# EAGLE design DC_Power (EAGLE 7.7.0)
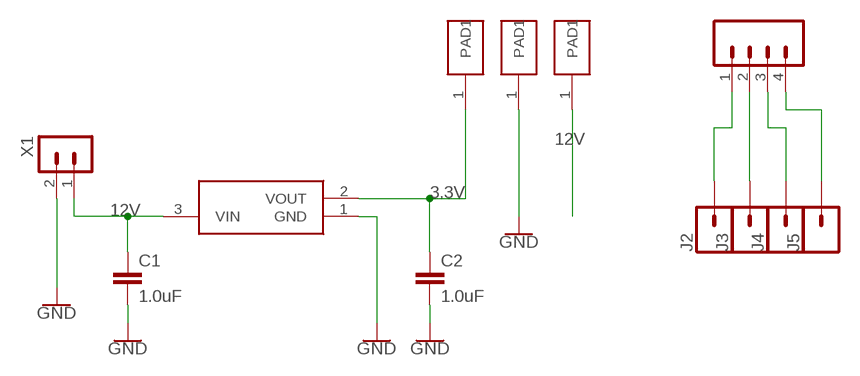
[diagram p0: schematic, sheet 1]

## Parts
C1  1.0uF  1.0UF-0805-25V-10%  [0805]
C2  1.0uF  1.0UF-0805-25V-10%  [0805]
IC1  MCP1700T-3302E_TT  [SOT95P237X112-3N]
J1  CONN_041.27MM  [1X04_1.27MM]
J2  CONN_01PTH_NO_SILK_YES_STOP  [1X01_NO_SILK]
J3  CONN_01PTH_NO_SILK_YES_STOP  [1X01_NO_SILK]
J4  CONN_01PTH_NO_SILK_YES_STOP  [1X01_NO_SILK]
J5  CONN_01PTH_NO_SILK_YES_STOP  [1X01_NO_SILK]
U$1  SINGLE_1.27MM_HOLE  [1.27MM_SINGLE_HOLE]
U$2  SINGLE_1.27MM_HOLE  [1.27MM_SINGLE_HOLE]
U$3  SINGLE_1.27MM_HOLE  [1.27MM_SINGLE_HOLE]
X1  BM02B-SRSS-TB  [BM02B-SRSS-TB]

## Nets
3.3V: C2.1 IC1.2(VOUT) U$1.1(PAD1)
12V: C1.1 IC1.3(VIN) U$3.1(PAD1) X1.1
GND: C1.2 C2.2 IC1.1(GND) U$2.1(PAD1) X1.2
N$1: J1.1 J2.1
N$2: J1.2 J3.1
N$3: J1.3 J4.1
N$4: J1.4 J5.1

## Library data of the parts
C1 C2 = SparkFun-Capacitors:1.0UF: 1µF ceramic capacitors A capacitor is a passive two-terminal electrical component used to store electrical energy temporarily in an electric field.; PROD_ID: CAP-08064
IC1 = MCXI_master_lib:MCP1700T-3302E_TT: LDO voltage regulator 250mA Isupply 1uA Source: Datasheet <https://datasheet.datasheetarchive.com/originals/distributors/SFDatasheet-4/sf-00090030.pdf>; DESCRIPTION: LDO voltage regulator 250mA Isupply 1uA; HEIGHT: 1.12mm; MANUFACTURER_NAME: Microchip; MANUFACTURER_PART_NUMBER: MCP1700T-3302E/TT; MOUSER_PART_NUMBER: 579-MCP1700T3302E/TT; MOUSER_PRICE-STOCK: https://www.mouser.co.uk/ProductDetail/Microchip-Technology-Atmel/MCP1700T-3302E-TT?qs=fM4xO01eazPmCNDrdHEdaw%3D%3D
J1 = MCXI_master_lib:CONN_04: Multi connection point. Often used as Generic Header-pin footprint for 0.1 inch spaced/style header connections On any of the 0.1 inch spaced packages, you can populate with these: Break Away Headers - Straight <https://www.sparkfun.com/products/116> (PRT-00116) Break Away Male Headers - Right Angle <https://www.sparkfun.com/products/553> (PRT-00553) Female Headers <https://www.sparkfun.com/products/115> (PRT-00115) Break Away Headers - Machine Pin <https://www.sparkfun.com/products/117> (PRT-00117) Break Away Female Headers - Swiss Machine Pin <https://www.sparkfun.com/products/743> (PRT-00743) For SCREWTERMINALS and SPRING TERMINALS visit here: Screw Terimnals on SparkFun.com <https://www.sparkfun.com/search/results?term=Screw+Terminals> (5mm/3.5mm/2.54mm spacing) This device is also useful as a general connection point to wire up your design to another part of your project. Our various solder wires solder well into these plated through hole pads. Hook-Up Wire - Assortment (Stranded, 22 AWG) <https://www.sparkfun.com/products/11375> (PRT-11375) Hook-Up Wire - Assortment (Solid Core, 22 AWG) <https://www.sparkfun.com/products/11367> (PRT-11367) View the entire wire category on our website here <https://www.sparkfun.com/categories/141> Special notes: Molex polarized connector foot print use with SKU : PRT-08231 with associated crimp pins and housings. 1MM SMD Version SKU: PRT-10208
J2-J5 = MCXI_master_lib:CONN_01: Single connection point. Often used as Generic Header-pin footprint for 0.1 inch spaced/style header connections On any of the 0.1 inch spaced packages, you can populate with these: Break Away Headers - Straight <https://www.sparkfun.com/products/116> (PRT-00116) Break Away Male Headers - Right Angle <https://www.sparkfun.com/products/553> (PRT-00553) Female Headers <https://www.sparkfun.com/products/115> (PRT-00115) Break Away Headers - Machine Pin <https://www.sparkfun.com/products/117> (PRT-00117) Break Away Female Headers - Swiss Machine Pin <https://www.sparkfun.com/products/743> (PRT-00743) This device is also useful as a general connection point to wire up your design to another part of your project. Our various solder wires solder well into these plated through hole pads. Hook-Up Wire - Assortment (Stranded, 22 AWG) <https://www.sparkfun.com/products/11375> (PRT-11375) Hook-Up Wire - Assortment (Solid Core, 22 AWG) <https://www.sparkfun.com/products/11367> (PRT-11367) View the entire wire category on our website here <https://www.sparkfun.com/categories/141> Special notes: SMTSO-256-ET is a "flush mount" nut for a 4-40 screw. We mostly use this on specialty testbeds; it is a nice way to connect hardware to your PCB at an adjustable hieght. Also note, the SNAP packages are for using a snappable style connector. We sell a baggie of snaps and they are also used on two LilyPad designs: Snap Assortment - 30 pack (male and female) <https://www.sparkfun.com/products/11347> (DEV-11347) LilyPad Arduino SimpleSnap <https://www.sparkfun.com/products/10941> (DEV-10941) LilyPad SimpleSnap Protoboard <https://www.sparkfun.com/products/10940> (DEV-10940)
U$1-U$3 = MCXI_master_lib:SINGLE_1.27MM_HOLE
X1 = con-JST SH:BM02B-SRSS: JST SH series header 1.00mm pitch disconnectable crimp style connectors, vertical (side entry type), 2 pins

## Board
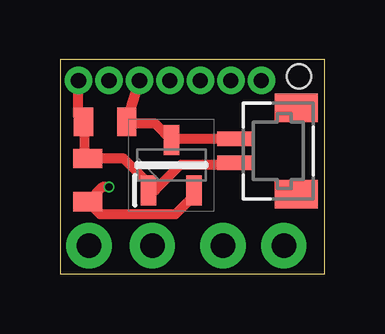
[diagram p1: board, top side]
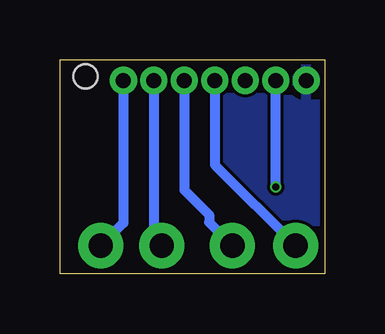
[diagram p2: board, bottom side, seen from below]

Size 11.03 x 8.93 mm. Coordinates in mm from the lower left corner, seen from the top.
Outline: 0,0 11.03,0 11.03,8.93 0,8.93 0,0
Copper layers (1*16): Top 0.035mm / dielectric 1.6mm / Bottom 0.035mm
Design rules "jlcpcb-2layers": minimum track width 5mil, minimum drill 0.3mm, track to track 5mil, track to pad 5mil, pad to pad 5mil, via to via 5mil, smd to smd 5mil, copper to edge 0.2mm, drill to drill 6mil, minimum pad ring 10mil, minimum via ring 3mil, stop-mask expansion 4mil, vias tented up to drill 0mil, thermal gap 10mil
Holes 1 mm at 9.96,8.24

### Footprints (pad centres in the part's own frame; a part is rotated, then mirrored left to right if it is on the bottom)
0805 = smd 0.8 x 1.2: 1 -0.9,0; 2 0.9,0
SOT95P237X112-3N = smd 1.25 x 0.65: 1 -1.05,0.95; 2 -1.05,-0.95; 3 1.05,0
1X04_1.27MM = drill 0.63 pad 1: 1 0,0; 2 1.27,0; 3 2.54,0; 4 3.81,0
1X01_NO_SILK = drill 1.016 pad 1.88: 1 0,0
1.27MM_SINGLE_HOLE = drill 0.63 pad 0.8: 1 0,0
BM02B-SRSS-TB = smd 0.6 x 1.55: 1 0.5,0; 2 -0.5,0 | smd 1.2 x 1.8: M1 1.8,-2.525; M2 -1.8,-2.525

### Placement (x,y rotation side)
C1  1.88,6.35 180 top
C2  1.15,3.91 90 top
IC1  4.64,4.54 90 top
J1  4.58,8.07 0 top
J2  1.21,1.18 0 top
J3  3.85,1.18 0 top
J4  6.79,1.18 0 top
J5  9.33,1.18 0 top
U$1  2.04,8.07 0 top
U$2  0.77,8.07 0 top
U$3  3.31,8.07 0 top
X1  7.32,5.13 90 top

### Tracks (layer width: path | path; a pad name or v marks a point on that pad's centre or on a via)
3.3V  (via drill 0.3)
  Top 0.127: 1.15,2.99 C2.1 | 5.47,3.37 IC1.2
  Top 0.406: v2.04,3.62 1.77,3.62 C2.1 1.67,2.49 4.81,2.49 5.47,3.15 5.47,3.37
  Bottom 0.406: v2.04,3.62 U$1.1
12V
  Top 0.127: 2.8,6.42 C1.1 2.8,6.29 | 4.58,5.66 IC1.3 4.71,5.66 | 7.25,5.66 X1.1
  Top 0.406: 2.8,6.42 3.15,7.54 U$3.1 | 2.8,6.29 3.94,6.29 IC1.3 | 4.71,5.66 7.29,5.66 X1.1
GND
  Top 0.127: 1.02,6.29 C1.2 0.9,6.42 0.77,6.55 | 1.02,4.89 C2.2 1.15,4.77 1.53,4.77 | 3.56,3.5 IC1.1 | 7.25,4.51 X1.2
  Top 0.406: 0.77,6.55 U$2.1 | 1.02,4.89 1.02,6.31 C1.2 | 3.56,3.5 3.56,3.91 2.66,4.81 C2.2 | IC1.1 3.98,3.5 5.04,4.56 7.25,4.56 X1.2
  pour Bottom: -0.31,9.1 -0.31,0.1 -0.31,-0.9 11.69,-0.9 11.69,10.1 -0.31,10.1
N$1
  Bottom 0.127: 1.28,1.21 J2.1
  Bottom 0.406: J1.1 4.58,4.55 J2.1
N$2
  Bottom 0.127: 3.95,1.21 J3.1
  Bottom 0.406: J1.2 5.85,3.5 4.82,2.47 4.82,2.15 J3.1
N$3
  Bottom 0.127: 7.12,1.47 6.87,1.21 J4.1
  Bottom 0.406: J1.3 7.12,1.51 J4.1
N$4
  Top 0.127: 9.28,1.21 J5.1
  Bottom 0.406: J1.4 8.39,2.12 J5.1